# EasyEDA schematic SCH_D69-600V_supply_2024-10-20.json
TITLE: Sheet_1; REV: 1.0; Date: 2024-09-14; Sheet: 1/1; Drawn By: Yarda89; Company: Your Company
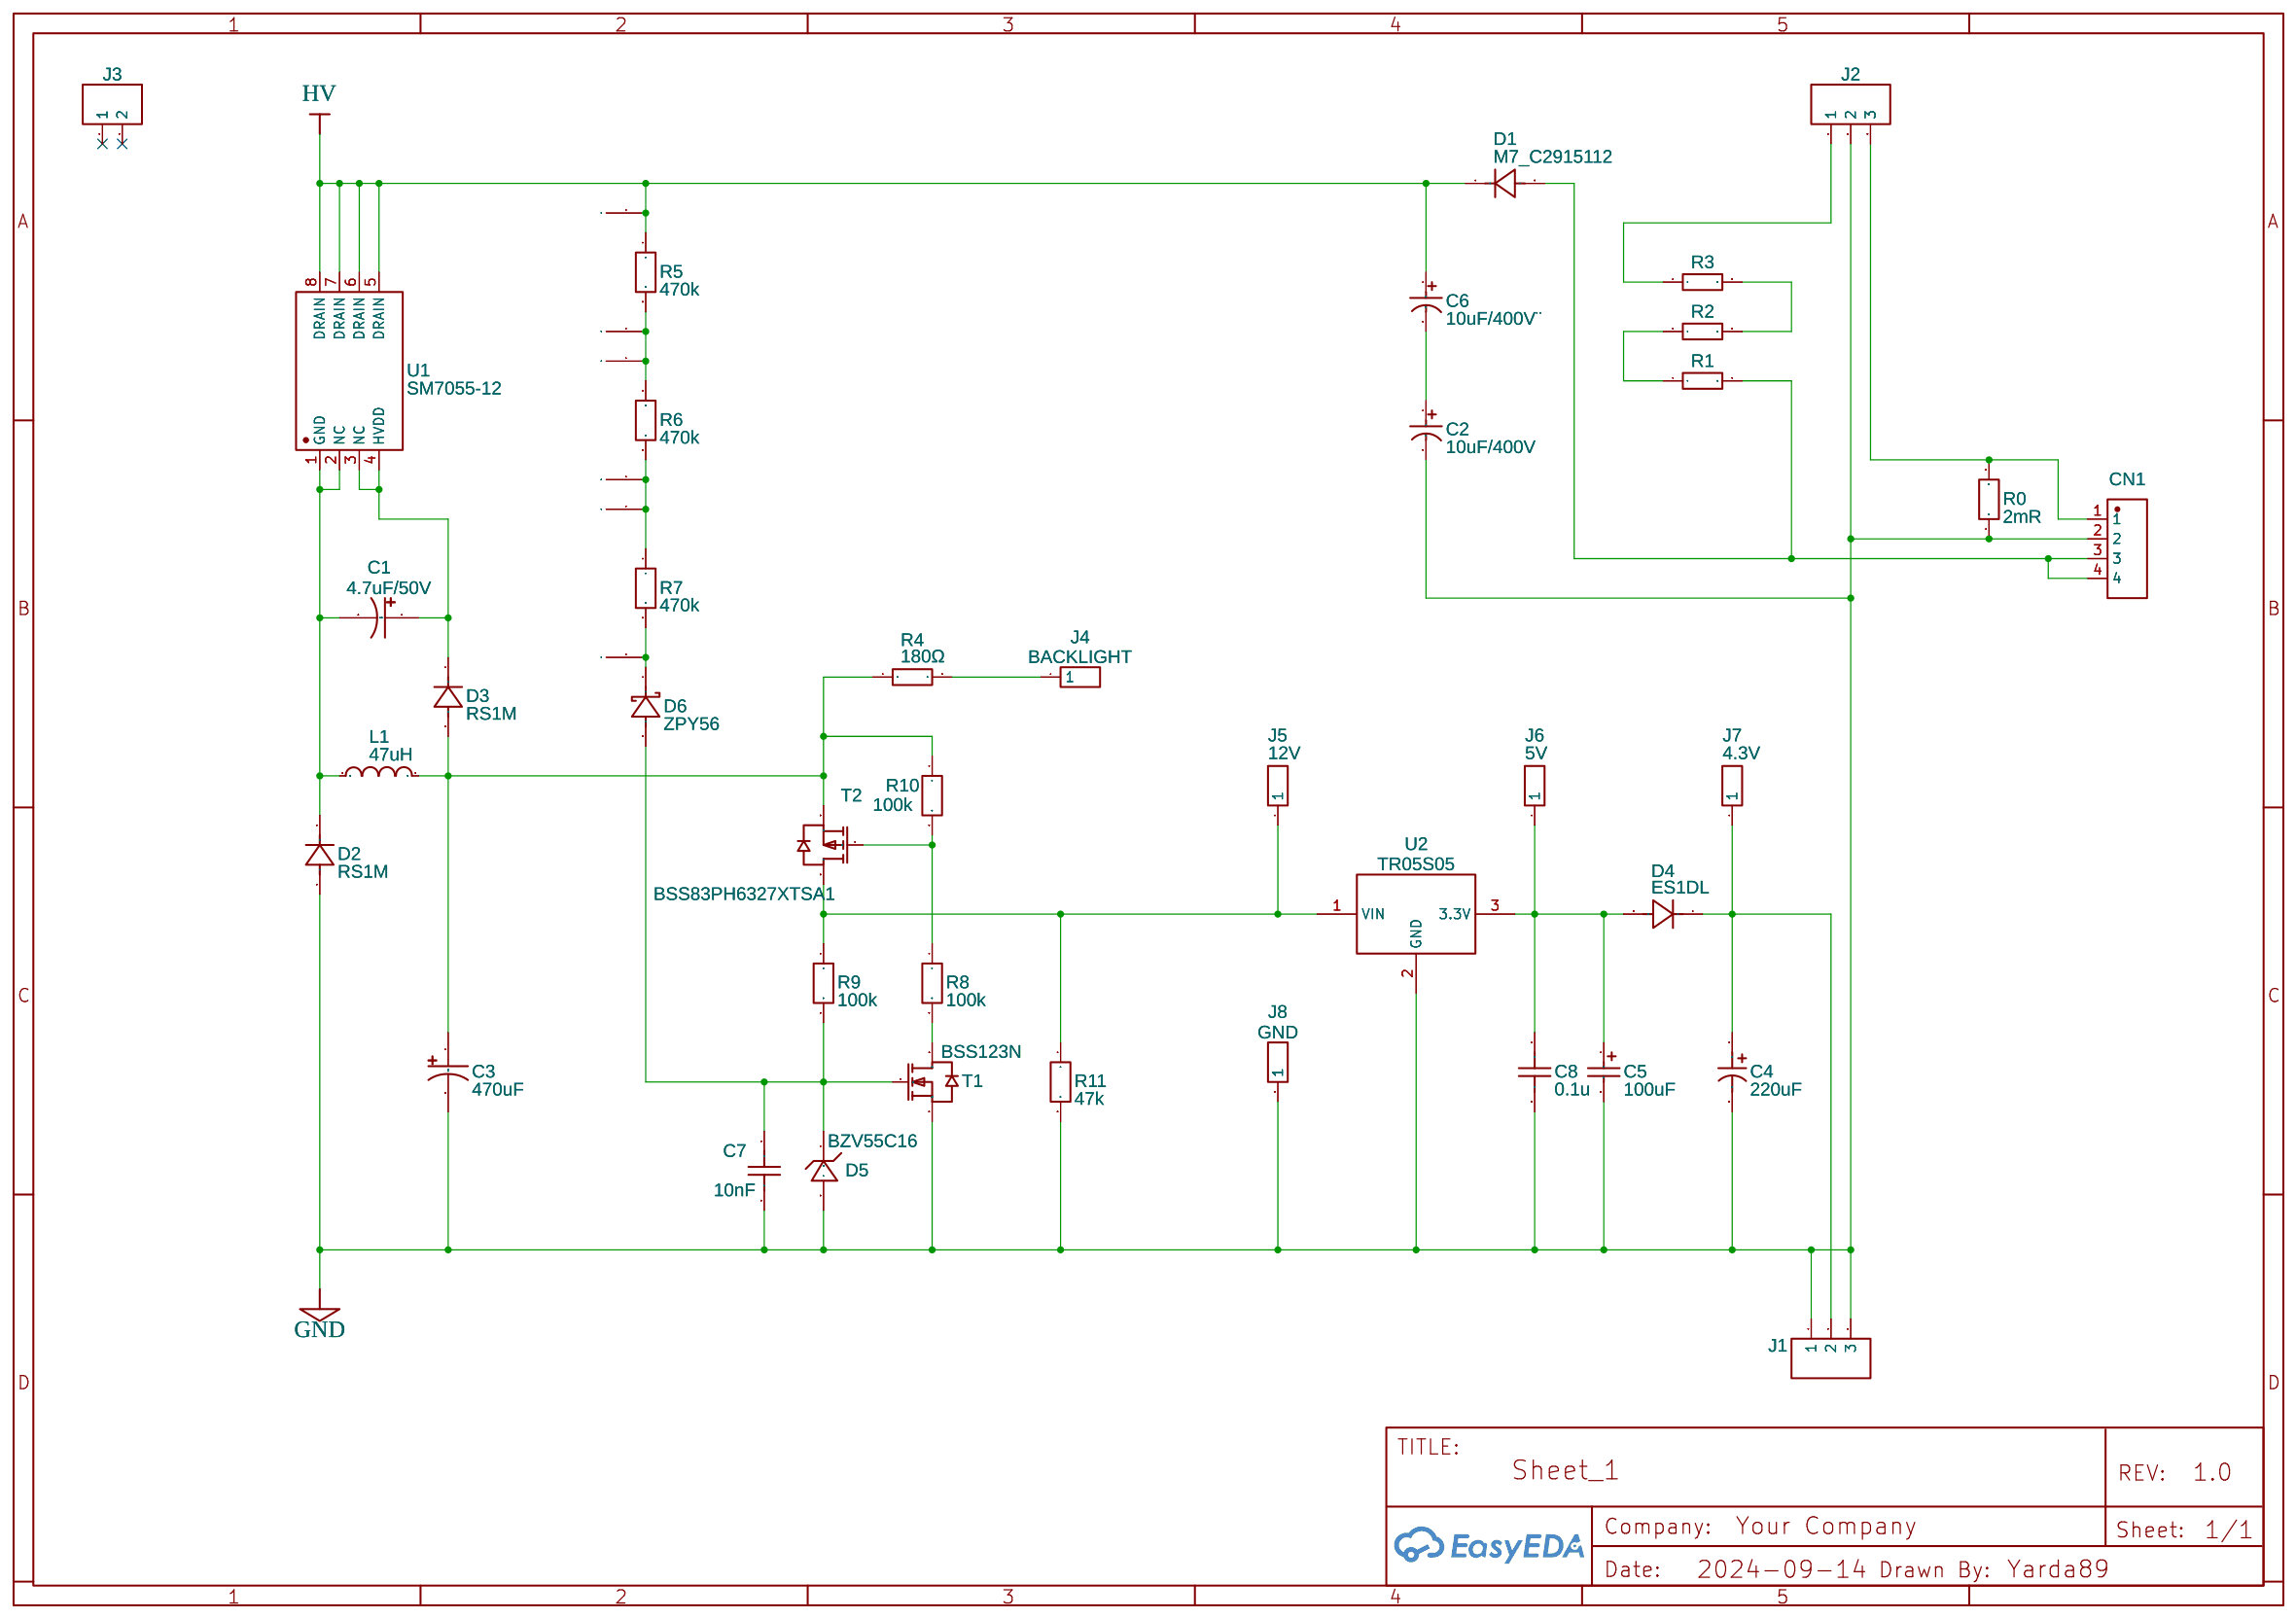
[diagram p0: schematic sheet]

## Parts
C1  4.7uF/50V  [CAP-TH_BD5.0-P2.00-D0.8-FD]
C2  10uF/400V  [CAP-TH_BD10.0-P5.00-D1.0-FD]
C3  470uF  [CAP-TH_BD8.0-P3.50-D0.6-FD_1]
C4  220uF  [CAP-TH_BD6.3-P2.50-D0.6-FD]
C5  100uF  [CASE-D_7343]
C6  10uF/400V¨  [CAP-TH_BD10.0-P5.00-D1.0-FD]
C7  10nF  [CAP-TH_L5.0-W2.5-P2.50-D0.5]
C8  0.1u  [C0603]
CN1  MX128-5.0-04P-GN01-CU-Y-A  [CONN-TH_4P-MX128-5.0-04P-GN01-CU-Y-A]
D1  M7_C2915112  [SMA_L4.0-W2.5-LS5.4-RD]
D2  RS1M  [SMA_L4.2-W2.7-LS5.3-RD]
D3  RS1M  [SMA_L4.2-W2.7-LS5.3-RD]
D4  ES1DL  [SOD-123FL_L2.8-W1.8-LS3.7-RD-1]
D5  BZV55C16  [SOD-80_L3.5-W1.5-RD]
D6  ZPY56  [DO-41_BD2.6-L4.1-P8.0-D0.9-RD]
J1  HDR-M-2.54_1x3  [HDR-M-2.54_1X3]
J2  HDR-M-2.54_1x3  [HDR-M-2.54_1X3]
J3  HDR-M-2.54_1x2  [HDR-M-2.54_1X2]
J4  BACKLIGHT  [HDR-M-2.54_1X1]
J5  12V  [HDR-M-2.54_1X1]
J6  5V  [HDR-M-2.54_1X1]
J7  4.3V  [HDR-M-2.54_1X1]
J8  GND  [HDR-M-2.54_1X1]
L1  47uH  [IND-TH_BD6.0-P3.00-D0.6]
R0  2mR  [R1812]
R1  510kΩ  [R1206]
R2  510kΩ  [R1206]
R3  510kΩ  [R1206]
R4  180Ω  [R1206]
R5  470k  [R1206]
R6  470k  [R1206]
R7  470k  [R1206]
R8  100k  [R0805]
R9  100k  [R0805]
R10  100k  [R0805]
R11  47k  [R_AXIAL-0.4]
T1  BSS123N  [SOT-23-3_L2.9-W1.3-P1.90-LS2.4-BR]
T2  BSS83PH6327XTSA1  [SOT-23-3_L2.9-W1.3-P1.90-LS2.4-BR]
U1  SM7055-12  [DIP-8_L9.2-W6.4-P2.54-LS8.7-BL]
U2  TR05S05  [TR05S]
U3  KX_PAD_SMD_3X1.5MM COPY COPY  [PADPAD]
U4  KX_PAD_SMD_3X1.5MM COPY COPY  [PADPAD]
U5  KX_PAD_SMD_3X1.5MM COPY COPY  [PADPAD]
U6  KX_PAD_SMD_3X1.5MM COPY COPY  [PADPAD]
U7  KX_PAD_SMD_3X1.5MM COPY COPY  [PADPAD]
U8  KX_PAD_SMD_3X1.5MM COPY COPY  [PADPAD]

## Library data of the parts
C1 = EEUFR1H4R7: Contributor: LCSC; Supplier: LCSC; Supplier Part: C178709; Manufacturer: PANASONIC(松下); JLCPCB Part Class: Extended Part
C2 C6 = UCS2G100MPD: Supplier: LCSC; Manufacturer: Nichicon(尼吉康); Supplier Part: C134223; JLCPCB Part Class: Extended Part
C3 = EEUFR1E471Y: Contributor: LCSC; Supplier: LCSC; Supplier Part: C264062; Manufacturer: PANASONIC(松下); JLCPCB Part Class: Extended Part
C4 = ECA1CM221: Contributor: lcsc; Supplier: LCSC; Supplier Part: C713151; Manufacturer: PANASONIC(松下)
C5 = TAJD107M016RNJ: Supplier: LCSC; Manufacturer: Kyocera AVX; Supplier Part: C11379; JLCPCB Part Class: Extended Part
C7 = CC1H103ZA1ED3F4D1100: Supplier: LCSC; Supplier Part: C2832505; Manufacturer: Dersonic(德尔创); Contributor: lcsc
C8 = C_0603_US: Contributor: LCEDA_Lib
CN1 = MX128-5.0-04P-GN01-CU-Y-A: Supplier: LCSC; Supplier Part: C5290369; Manufacturer: MAX(迈旭); Manufacturer Part: MX128-5.0-04P-GN01-Cu-Y-A; Contributor: lcsc; JLCPCB Part Class: Extended Part
D1 = M7_C2915112: Contributor: lcsc; Convert to PCB: Yes; Add into BOM: Yes; Supplier: LCSC; Supplier Part: C2915112; Manufacturer: GOODWORK(固得沃克); Manufacturer Part: M7; JLCPCB Part Class: Extended Part
D2 D3 = RS1M: Contributor: lcsc; Supplier: LCSC; Supplier Part: C2887512; Manufacturer: YFSEMI(江苏佑风微); JLCPCB Part Class: Extended Part
D4 = ES1DL: Contributor: lcsc; Supplier: LCSC; Supplier Part: C2923901; Manufacturer: CJ(江苏长电/长晶); JLCPCB Part Class: Extended Part
D5 = BZV55C16: Contributor: LCSC; Supplier: LCSC; Supplier Part: C545333; Manufacturer: LGE(鲁光); JLCPCB Part Class: Extended Part
D6 = ZPY56: Contributor: LCSC; Supplier: LCSC; Supplier Part: C9900007866; Manufacturer: null; JLCPCB Part Class: Extended Part
J1 J2 = HDR-M-2.54_1x3: Supplier Part: C180248; Supplier: LCSC; Contributor: LCEDA_Lib
J3 = HDR-M-2.54_1x2: Supplier Part: C124375; Supplier: LCSC; Contributor: LCEDA_Lib
J4-J8 = HDR-M-2.54_1x1: Supplier Part: C81276; Supplier: LCSC; Contributor: LCEDA_Lib
L1 = SLP0608R-470MTT: Contributor: LCSC; Supplier: LCSC; Supplier Part: C326017; Manufacturer: Sunltech(韩国顺磁); JLCPCB Part Class: Extended Part
R0 = R_1812_EU: Contributor: LCEDA_Lib
R1-R3 = 1206W4F5103T5E: Supplier: LCSC; Manufacturer: UNI-ROYAL(厚声); Supplier Part: C17990; JLCPCB Part Class: Extended Part
R4 = 1206W4F1800T5E: Supplier: LCSC; Manufacturer: UNI-ROYAL(厚声); Supplier Part: C17924; JLCPCB Part Class: Extended Part
R5-R7 = R_1206_EU: Contributor: LCEDA_Lib
R8-R10 = R_0805_EU: Contributor: LCEDA_Lib
R11 = R_AXIAL-0.4_EU: Contributor: LCEDA_Lib
T1 = BSS123N: Supplier: LCSC; Supplier Part: C5157720; Manufacturer: Infineon(英飞凌); link: https://atta.szlcsc.com/upload/public/pdf/source/20220902/530D2697DA23334320D1FFC7EA0F91D5.pdf; Contributor: lcsc
T2 = BSS83PH6327XTSA1: Supplier: LCSC; Supplier Part: C116182; Manufacturer: Infineon Technologies; Contributor: LCSC; JLCPCB Part Class: Extended Part
U1 = SM7055-12: Supplier: LCSC; Manufacturer: 明微; Supplier Part: C129310; JLCPCB Part Class: Extended Part
U2 = TR05S3V3: Manufacturer Part: 1470-2257-5-ND; Contributor: Brad Lotsberg; Supplier Part: 1470-2257-5-ND; Supplier: Digi-Key
U3-U8 = KX_PAD_SMD_3X1.5MM COPY COPY: Contributor: f Beltran

## Nets
GND: C2.2 C3.2 C4.2 C5.2 C7.2 C8.2 CN1.2 D2.2(A) D5.2(A) J1.1 J1.3 J2.2 J8.1 R0.1 R11.2 T1.2(S) U2.2(GND)
HV: C6.1 D1.1(K) R5.1 U1.5(DRAIN) U1.6(DRAIN) U1.7(DRAIN) U1.8(DRAIN) U3.1
Net-(C1-1): C1.1 D3.1(K) U1.3(NC) U1.4(HVDD)
Net-(C1-2): C1.2 D2.1(K) L1.1 U1.1(GND) U1.2(NC)
Net-(C2-1): C2.1 C6.2
Net-(C3-1): C3.1 D3.2(A) L1.2 R4.1 R10.1 T2.2(S)
Net-(C4-1): C4.1 D4.1(K) J1.2 J7.1
Net-(C5-1): C5.1 C8.1 D4.2(A) J6.1 U2.3(3.3V)
Net-(C7-1): C7.1 D5.1(C) D6.2(A) R9.2 T1.1(G)
Net-(CN1-1): CN1.1 J2.3 R0.2
Net-(CN1-3): CN1.3 CN1.4 D1.2(A) R1.2
Net-(D6-1): D6.1(K) R7.2 U6.1
Net-(J2-1): J2.1 R3.1
Net-(J4-1): J4.1 R4.2
Net-(J5-1): J5.1 R9.1 R11.1 T2.3(D) U2.1(VIN)
Net-(R1-1): R1.1 R2.1
Net-(R2-2): R2.2 R3.2
Net-(R5-2): R5.2 R6.1 U4.1 U8.1
Net-(R6-2): R6.2 R7.1 U5.1 U7.1
Net-(R8-1): R8.1 R10.2 T2.1(G)
Net-(R8-2): R8.2 T1.3(D)

Not connected (* = marked no-connect by the designer): J3 1* 2*
